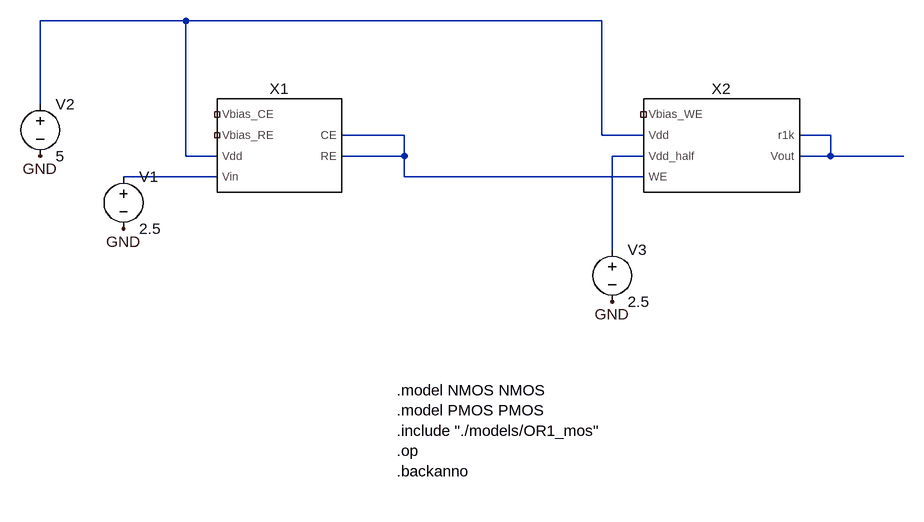
[diagram p0: schematic 1umtestbe.asc]
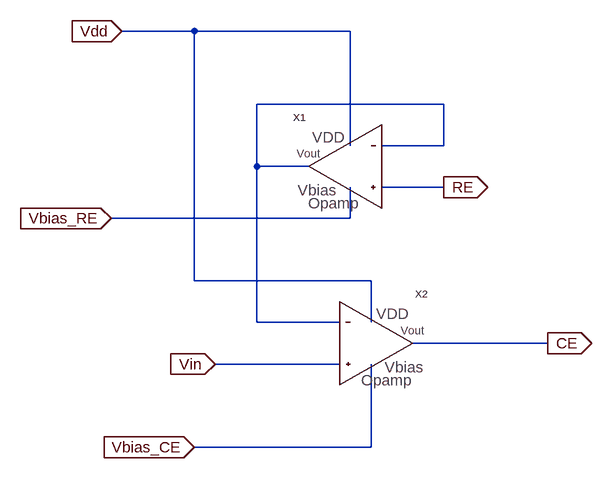
[diagram p1: sub-circuit 1umcontrol.asc]
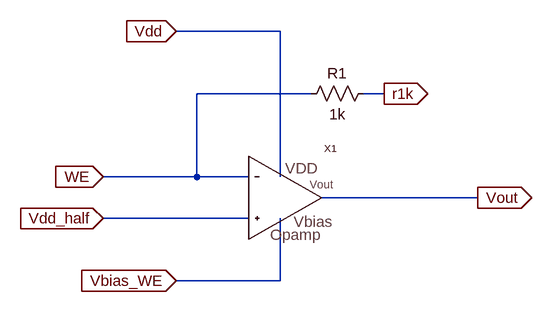
[diagram p2: sub-circuit 1umiv_conv.asc]
1umtestbe.asc, the LTspice schematic file:
Version 4
SHEET 1 884 680
WIRE -224 112 -448 112
WIRE 416 112 -224 112
WIRE -448 240 -448 112
WIRE 112 288 16 288
WIRE 416 288 416 112
WIRE 480 288 416 288
WIRE 768 288 720 288
WIRE -224 320 -224 112
WIRE -176 320 -224 320
WIRE 112 320 112 288
WIRE 112 320 16 320
WIRE 480 320 432 320
WIRE 768 320 768 288
WIRE 768 320 720 320
WIRE 880 320 768 320
WIRE -176 352 -320 352
WIRE 112 352 112 320
WIRE 480 352 112 352
WIRE 432 464 432 320
FLAG -448 320 GND
FLAG -320 432 GND
FLAG 432 544 GND
SYMBOL 1umcontrol -80 304 R0
SYMATTR InstName X1
SYMBOL 1umiv_conv 592 304 R0
SYMATTR InstName X2
SYMBOL voltage -320 336 R0
WINDOW 123 0 0 Left 0
WINDOW 39 0 0 Left 0
SYMATTR InstName V1
SYMATTR Value 2.5
SYMBOL voltage -448 224 R0
WINDOW 123 0 0 Left 0
WINDOW 39 0 0 Left 0
SYMATTR InstName V2
SYMATTR Value 5
SYMBOL voltage 432 448 R0
WINDOW 123 0 0 Left 0
WINDOW 39 0 0 Left 0
SYMATTR InstName V3
SYMATTR Value 2.5
TEXT 100 680 Left 0 !.model NMOS NMOS\n.model PMOS PMOS\n.include "./models/OR1_mos"\n.op\n.backanno\n

1umcontrol.asc, the sub-circuit schematic file:
Version 4
SHEET 1 880 680
WIRE 32 -336 -80 -336
WIRE 272 -336 32 -336
WIRE 416 -224 128 -224
WIRE 272 -160 272 -336
WIRE 416 -160 416 -224
WIRE 416 -160 320 -160
WIRE 128 -128 128 -224
WIRE 208 -128 128 -128
WIRE 416 -96 320 -96
WIRE 272 -48 272 -96
WIRE 272 -48 -96 -48
WIRE 32 48 32 -336
WIRE 304 48 32 48
WIRE 128 112 128 -128
WIRE 256 112 128 112
WIRE 304 112 304 48
WIRE 576 144 368 144
WIRE 256 176 64 176
WIRE 304 304 304 176
WIRE 304 304 32 304
FLAG 64 176 Vin
IOPIN 64 176 In
FLAG -80 -336 Vdd
IOPIN -80 -336 In
FLAG -96 -48 Vbias_RE
IOPIN -96 -48 In
FLAG 32 304 Vbias_CE
IOPIN 32 304 In
FLAG 416 -96 RE
IOPIN 416 -96 Out
FLAG 576 144 CE
IOPIN 576 144 Out
SYMBOL Opamp3ureiauto 240 -128 M0
SYMATTR InstName X1
SYMBOL Opamp3ureiauto 336 144 R0
SYMATTR InstName X2

1umiv_conv.asc, the sub-circuit schematic file:
Version 4
SHEET 1 880 680
WIRE 144 -64 -16 -64
WIRE 192 32 16 32
WIRE 304 32 272 32
WIRE 16 160 16 32
WIRE 16 160 -128 160
WIRE 96 160 16 160
WIRE 144 160 144 -64
WIRE 448 192 208 192
WIRE 96 224 -128 224
WIRE 144 320 144 224
WIRE 144 320 -16 320
FLAG -128 160 WE
IOPIN -128 160 In
FLAG -16 -64 Vdd
IOPIN -16 -64 In
FLAG -128 224 Vdd_half
IOPIN -128 224 In
FLAG -16 320 Vbias_WE
IOPIN -16 320 In
FLAG 304 32 r1k
IOPIN 304 32 Out
FLAG 448 192 Vout
IOPIN 448 192 Out
SYMBOL Opamp3ureiauto 176 192 R0
SYMATTR InstName X1
SYMBOL res 288 16 R90
WINDOW 0 0 56 VBottom 2
WINDOW 3 32 56 VTop 2
SYMATTR InstName R1
SYMATTR Value 1k

The netlist it stands for:
* 1umtestbe.asc
XX1 NC_01 NC_02 N001 N005 N002 N002 1umcontrol
XX2 NC_03 N001 N004 N002 N003 N003 1umiv_conv
V1 N005 GND 2.5
V2 N001 GND 5
V3 N004 GND 2.5

* block symbol definitions
.subckt 1umcontrol Vbias_CE Vbias_RE Vdd Vin CE RE
XX1 N001 RE N001 Vdd Vbias_RE Opamp3ureiauto  ; pins Vinm Vinp Vout VDD Vbias
XX2 N001 Vin CE Vdd Vbias_CE Opamp3ureiauto  ; pins Vinm Vinp Vout VDD Vbias
.ends 1umcontrol

.subckt 1umiv_conv Vbias_WE Vdd Vdd_half WE r1k Vout
XX1 WE Vdd_half Vout Vdd Vbias_WE Opamp3ureiauto  ; pins Vinm Vinp Vout VDD Vbias
R1 r1k WE 1k
.ends 1umiv_conv

.model NMOS NMOS
.model PMOS PMOS
.include "./models/OR1_mos"
.op
.backanno
.backanno
.end